# Altium schematic sheet Relay.SchDoc
size A4
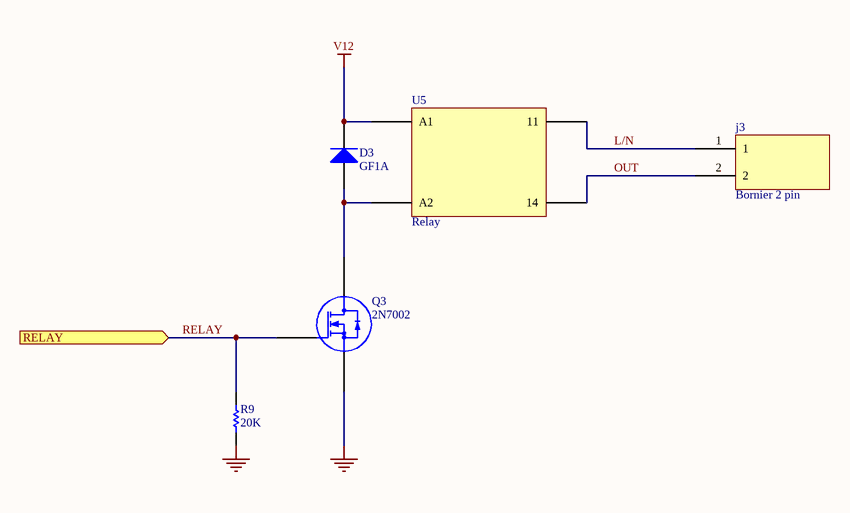
[diagram p0: Relay.SchDoc]

## Parts
D3  GF1A  [SMA/DO-214AC_21]
j3  Bornier 2 pin  [Bornier 2 pin]
Q3  2N7002  [TO-236AB]
R9  20K  [RES 0603]  (no BOM)
U5  Relay  [Relay]

## Ports
RELAY (in)

## Nets
GND: Q3.2(S) R9.2
V12: D3.2(K) U5.A1
L/N: j3.1 U5.11
OUT: j3.2 U5.14
RELAY: Q3.1(G) R9.1 ; port RELAY
NetD3_1: D3.1(A) Q3.3(D) U5.A2

## Notes on the sheet
- Title
- Size:
- Date:
- A4
- Number:
- Time:
- Revision:
- Sheet
- of
- File:

## Library data of the parts
D3 = Diode: Default Diode; Fabricant: VISHAY; RefFabricant: GF1A-E3/67A; Fournisseur: Farnell; RefFournisseur: 9549560; Published: 8-Jun-2000; LatestRevisionDate: 17-Jul-2002; LatestRevisionNote: Re-released for DXP Platform.; PackageVersion: Sep-1996; PackageReference: SMC; Publisher: Altium Limited; PackageDescription: DO-214-AB/SMC; 2 C-Bend Leads; Body 7.9 x 5.9 mm, inc. leads (LxW); Code_JEDEC: DO-214-AB
j3 = Header 2 pin: RefFournisseur: 3041359; Fabricant: PHOENIX CONTACT; Fournisseur: Farnell; RefFabricant: 1725656
Q3 = 2N7002: Transistor MOSFET, Canal N, 300 mA, 60 V, 2.8 ohm, 10 V, 2 V; Fabricant: NEXPERIA; Fournisseur: Farnell; RefFabricant: 2N7002,215; RefFournisseur: 1510761
R9 = Res1: Resistor; Value: 100K; Fournisseur: Farnell; RefFournisseur: 1108917; Fabricant: WELWYN; RefFabricant: PCF0805-13-100K-B-T1; Published: 8-Jun-2000; LatestRevisionDate: 17-Jul-2002; LatestRevisionNote: Re-released for DXP Platform.; PackageReference: AXIAL-0.3; Publisher: Altium Limited; PackageDescription: Axial Device, Thru-Hole; 2 Leads; 0.3 in Pin Spacing
U5 = Relay: Relais de puissance; Fabricant: TE CONNECTIVITY / OEG; RefFabricant: PCFN-112H2MS; Fournisseur: Farnell; RefFournisseur: 2504686